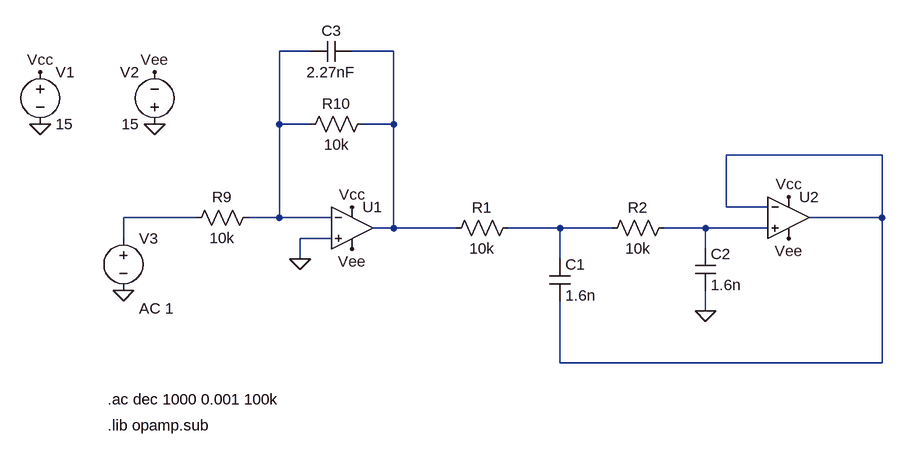
[diagram p0: schematic demodulador.asc]
demodulador.asc, the LTspice schematic file:
Version 4.1
SHEET 1 880 680
WIRE -288 -128 -336 -128
WIRE -160 -128 -224 -128
WIRE -336 -16 -336 -128
WIRE -288 -16 -336 -16
WIRE -160 -16 -160 -128
WIRE -160 -16 -208 -16
WIRE 592 32 352 32
WIRE 352 112 352 32
WIRE 416 112 352 112
WIRE -464 128 -576 128
WIRE -336 128 -336 -16
WIRE -336 128 -384 128
WIRE -256 128 -336 128
WIRE 592 128 592 32
WIRE 592 128 480 128
WIRE -160 144 -160 -16
WIRE -160 144 -192 144
WIRE -64 144 -160 144
WIRE 96 144 16 144
WIRE 176 144 96 144
WIRE 320 144 256 144
WIRE 416 144 320 144
WIRE -576 160 -576 128
WIRE -256 160 -304 160
WIRE 320 176 320 144
WIRE -304 192 -304 160
WIRE 96 192 96 144
WIRE 320 272 320 240
WIRE 96 352 96 256
WIRE 592 352 592 128
WIRE 592 352 96 352
FLAG 320 272 0
FLAG -304 192 0
FLAG -704 -96 Vcc
FLAG -224 112 Vcc
FLAG 448 96 Vcc
FLAG -528 -96 Vee
FLAG -224 176 Vee
FLAG 448 160 Vee
FLAG -528 -16 0
FLAG -704 -16 0
FLAG -576 240 0
SYMBOL res 32 128 R90
WINDOW 0 0 56 VBottom 2
WINDOW 3 32 56 VTop 2
SYMATTR InstName R1
SYMATTR Value 10k
SYMBOL res 272 128 R90
WINDOW 0 0 56 VBottom 2
WINDOW 3 32 56 VTop 2
SYMATTR InstName R2
SYMATTR Value 10k
SYMBOL cap 80 192 R0
SYMATTR InstName C1
SYMATTR Value 1.6n
SYMBOL cap 304 176 R0
SYMATTR InstName C2
SYMATTR Value 1.6n
SYMBOL res -192 -32 R90
WINDOW 0 0 56 VBottom 2
WINDOW 3 32 56 VTop 2
SYMATTR InstName R10
SYMATTR Value 10k
SYMBOL cap -224 -144 R90
WINDOW 0 0 32 VBottom 2
WINDOW 3 32 32 VTop 2
SYMATTR InstName C3
SYMATTR Value 2.27nF
SYMBOL res -368 112 R90
WINDOW 0 0 56 VBottom 2
WINDOW 3 32 56 VTop 2
SYMATTR InstName R9
SYMATTR Value 10k
SYMBOL voltage -704 -112 R0
WINDOW 123 0 0 Left 0
WINDOW 39 0 0 Left 0
SYMATTR InstName V1
SYMATTR Value 15
SYMBOL voltage -528 0 R180
WINDOW 0 24 96 Left 2
WINDOW 3 24 16 Left 2
WINDOW 123 0 0 Left 0
WINDOW 39 0 0 Left 0
SYMATTR InstName V2
SYMATTR Value 15
SYMBOL voltage -576 144 R0
WINDOW 123 24 124 Left 2
WINDOW 39 0 0 Left 0
SYMATTR InstName V3
SYMATTR Value ""
SYMATTR Value2 AC 1
SYMBOL OpAmps\\UniversalOpAmp1 -224 144 R0
SYMATTR InstName U1
SYMBOL OpAmps\\UniversalOpAmp1 448 128 R0
SYMATTR InstName U2
TEXT -600 408 Left 2 !.ac dec 1000 0.001 100k
TEXT -600 448 Left 2 !.lib opamp.sub

The netlist it stands for:
* demodulador.asc
R1 N005 N002 10k
R2 N006 N005 10k
C1 N005 N003 1.6n
C2 N006 0 1.6n
R10 N002 N001 10k
C3 N002 N001 2.27nF
R9 N001 N004 10k
V1 Vcc 0 15
V2 0 Vee 15
V3 N004 0 AC 1
X§U1 0 N001 Vcc Vee N002 level1 Avol=1Meg GBW=10Meg Vos=0 En=0 Enk=0 In=0 Ink=0 Rin=500Meg  ; pins In+ In- V+ V- OUT
X§U2 N006 N003 Vcc Vee N003 level1 Avol=1Meg GBW=10Meg Vos=0 En=0 Enk=0 In=0 Ink=0 Rin=500Meg  ; pins In+ In- V+ V- OUT
.ac dec 1000 0.001 100k
.lib opamp.sub
.lib UniversalOpAmp1.lib
.backanno
.end